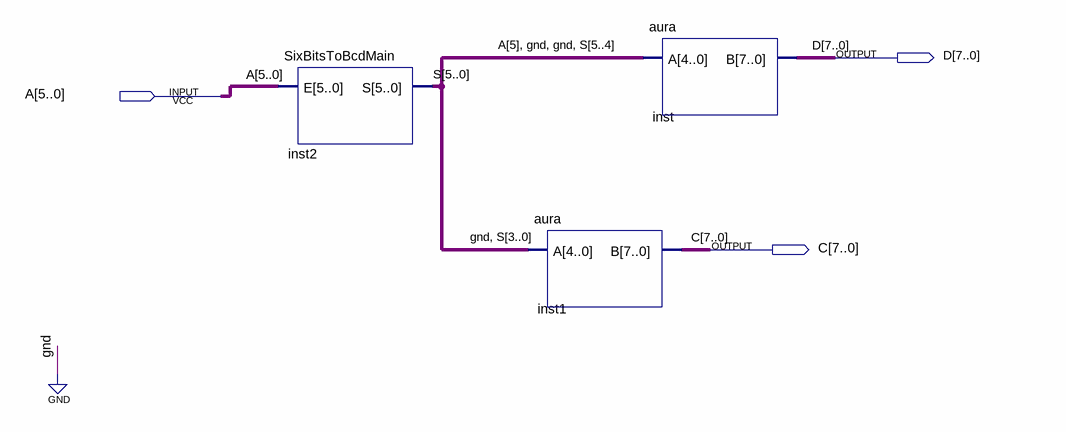
[diagram p0: schematic sheet]
// Quartus schematic decoder.bdf as structural Verilog: 3 symbols, 3 pins
module decoder (
  input  [5:0] A,
  output [7:0] D,
  output [7:0] C
);

  wire [5:0] S;

  SixBitsToBcdMain inst2 (.E(A), .S(S));
  aura inst1 (.A({1'b0, S[3:0]}), .B(C));
  aura inst (.A({A[5], 2'b00, S[5:4]}), .B(D));
endmodule
